# EAGLE design tinyPixel - rev A (EAGLE 6.3)
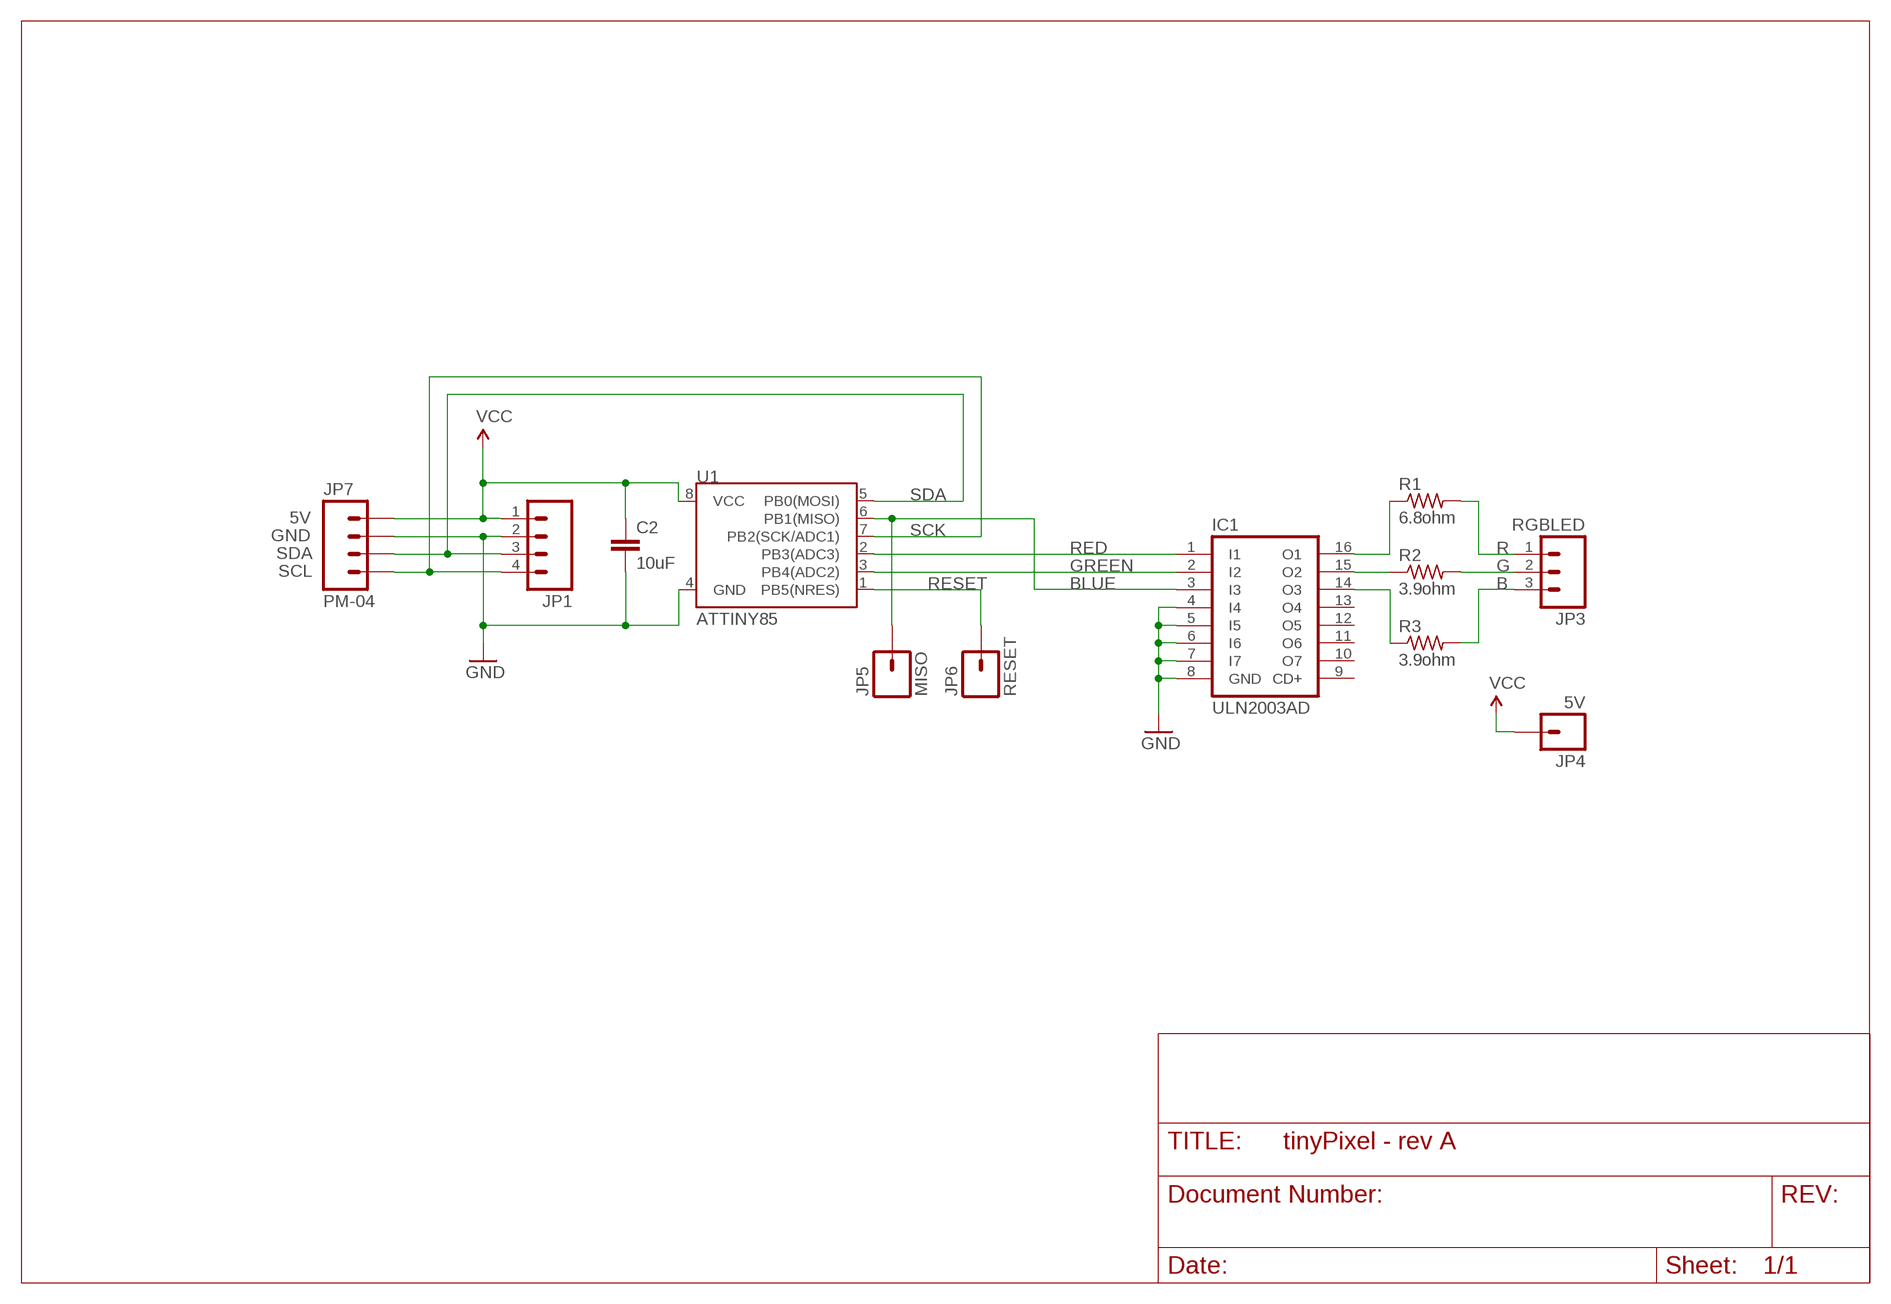
[diagram p0: schematic, sheet 1]

## Parts
C2  10uF  CAP0805  [0805]
IC1  ULN2003AD  [SO16]
JP1  M04PTH  [1X04]
JP3  RGBLED  M03PTH  [1X03]
JP4  5V  M01PTH  [1X01]
JP5  MISO  M01-SMD  [M01-SMD]
JP6  RESET  M01-SMD  [M01-SMD]
JP7  PM-04  [PM-04]
R1  6.8ohm  R-US_0411/12  [0411/12]
R2  3.9ohm  R-US_0411/12  [0411/12]
R3  3.9ohm  R-US_0411/12  [0411/12]
U1  ATTINY85  ATTINY45TINY85-20-SMT  [SO08-EIAJ]

## Nets
B: JP3.3 R3.2
BLUE: IC1.3(I3) JP5.P$2 U1.6(PB1(MISO))
G: JP3.2 R2.2
GND: C2.2 IC1.4(I4) IC1.5(I5) IC1.6(I6) IC1.7(I7) IC1.8(GND) JP1.2 JP7.P$3 U1.4(GND)
GREEN: IC1.2(I2) U1.3(PB4(ADC2))
N$1: IC1.15(O2) R2.1
N$3: IC1.14(O3) R3.1
N$5: IC1.16(O1) R1.1
R: JP3.1 R1.2
RED: IC1.1(I1) U1.2(PB3(ADC3))
RESET: JP6.P$2 U1.1(PB5(NRES))
SCK: JP1.4 JP7.P$1 U1.7(PB2(SCK/ADC1))
SDA: JP1.3 JP7.P$2 U1.5(PB0(MOSI))
VCC: C2.1 JP1.1 JP4.1 JP7.P$4 U1.8(VCC)
Unconnected: IC1.9(CD+) IC1.10(O7) IC1.11(O6) IC1.12(O5) IC1.13(O4)

## Notes on the sheet
- 5V
- GND
- SDA
- SCL

## Library data of the parts
C2 = SparkFun-Capacitors:CAP: Capacitor Standard 0603 ceramic capacitor, and 0.1" leaded capacitor.
IC1 = uln-udn:ULN2003A: DRIVER ARRAY
JP1 = SparkFun-Connectors:M04: Header 4 Standard 4-pin 0.1" header. Use with straight break away headers (SKU : PRT-00116), right angle break away headers (PRT-00553), swiss pins (PRT-00743), machine pins (PRT-00117), and female headers (PRT-00115). Molex polarized connector foot print use with SKU : PRT-08231 with associated crimp pins and housings. 1MM SMD Version SKU: PRT-10208
JP3 = SparkFun-Connectors:M03: Header 3 Standard 3-pin 0.1" header. Use with straight break away headers (SKU : PRT-00116), right angle break away headers (PRT-00553), swiss pins (PRT-00743), machine pins (PRT-00117), and female headers (PRT-00115). Molex polarized connector foot print use with SKU : PRT-08232 with associated crimp pins and housings.
JP4 = SparkFun-Connectors:M01: Header 1 Standard 1-pin 0.1" header. Use with straight break away headers (SKU : PRT-00116), right angle break away headers (PRT-00553), swiss pins (PRT-00743), machine pins (PRT-00117), and female headers (PRT-00115).
JP5 JP6 = custom-parts:M01-SMD
JP7 = custom-parts:PM-04
R1-R3 = resistor:R-US_: RESISTOR, American symbol
U1 = SparkFun-DigitalIC:ATTINY45: Atmel 8-pin 2/4/8kB flash uC; PROD_ID: IC-09092; VALUE: Tiny85-20-SMT

## Board
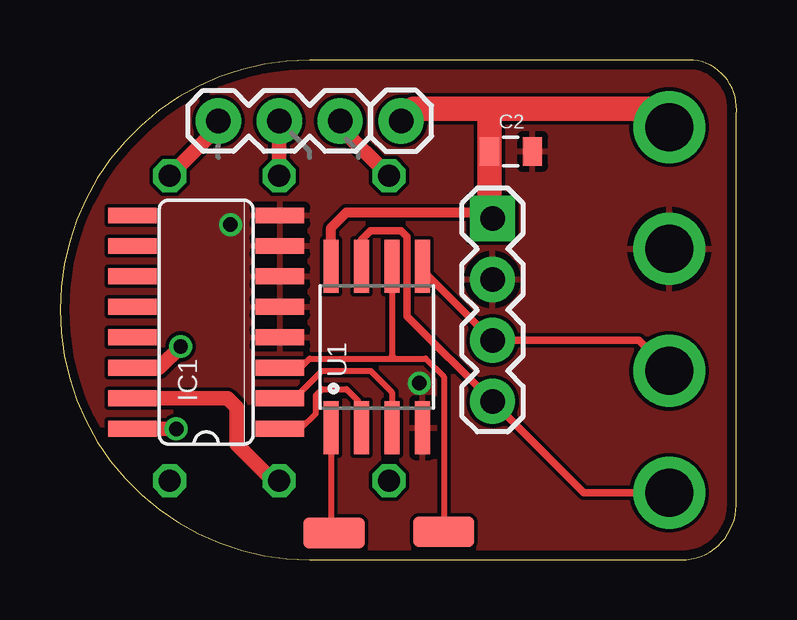
[diagram p1: board, top side]
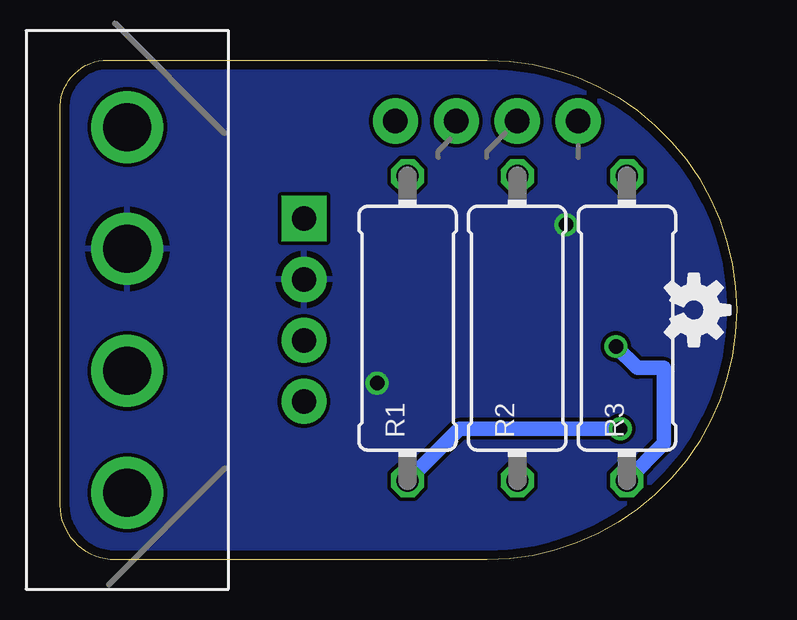
[diagram p2: board, bottom side, seen from below]

Size 28.21 x 20.83 mm. Coordinates in mm from the lower left corner, seen from the top.
Outline: 0,10.41 arc90 10.41,0 25.91,0 arc90 28.19,2.29 28.19,18.54 arc90 26.42,20.83 10.41,20.83 arc90 0,10.41
Copper layers (1*16): Top 0.0356mm / dielectric 1.5011mm / Bottom 0.0356mm
Design rules "LaenPCBOrder": minimum track width 6mil, minimum drill 13mil, track to track 6mil, track to pad 6mil, pad to pad 6mil, via to via 6mil, smd to smd 6mil, copper to edge 15mil, drill to drill 6mil, minimum pad ring 7mil, minimum via ring 7mil, stop-mask expansion 4mil, vias tented up to drill 0mil, thermal gap 10mil

### Footprints (pad centres in the part's own frame; a part is rotated, then mirrored left to right if it is on the bottom)
0805 = smd 0.8 x 1.2: 1 -0.9,0; 2 0.9,0
SO16 = smd 0.66 x 2.032: 1 -4.445,-3.073; 2 -3.175,-3.073; 3 -1.905,-3.073; 4 -0.635,-3.073; 5 0.635,-3.073; 6 1.905,-3.073; 7 3.175,-3.073; 8 4.445,-3.073; 9 4.445,3.073; 10 3.175,3.073; 11 1.905,3.073; 12 0.635,3.073; 13 -0.635,3.073; 14 -1.905,3.073; 15 -3.175,3.073; 16 -4.445,3.073
1X04 = drill 1.016 pad 1.88 square: 1 0,0 | drill 1.016 pad 1.88: 2 2.54,0; 3 5.08,0; 4 7.62,0
1X03 = drill 1.016 pad 1.88: 1 0,0; 2 2.54,0; 3 5.08,0
1X01 = drill 1.016 pad 1.88: 1 0,0
M01-SMD = smd 2.54 x 1.27: P$2 0,0
PM-04 = drill 2: P$1 -7.62,0; P$2 -2.54,0; P$3 2.54,0; P$4 7.62,0
0411/12 = drill 0.914 octagon: 1 -6.35,0; 2 6.35,0
SO08-EIAJ = smd 0.61 x 2.21: 1 -1.905,-3.378; 2 -0.635,-3.378; 3 0.635,-3.378; 4 1.905,-3.378; 5 1.905,3.353; 6 0.635,3.353; 7 -0.635,3.353; 8 -1.905,3.353

### Placement (x,y rotation side)
C2  18.8,17.02 0 top
IC1  6.1,9.91 90 top
JP1  18.03,14.22 270 top
JP3  11.68,18.29 180 top
JP4  14.22,18.29 0 top
JP5  16,1.17 180 top
JP6  11.43,1.12 0 top
JP7  25.4,10.41 90 bottom
R1  13.72,9.65 90 bottom
R2  9.14,9.65 90 bottom
R3  4.57,9.65 90 bottom
U1  13.21,8.89 0 top
U$1  [OSHW-LOGO-S]  1.78,10.41 270 bottom

### Tracks (layer width: path | path; a pad name or v marks a point on that pad's centre or on a via)
B
  Top 0.61: R3.2 6.6,18.03 JP3.3
BLUE
  Top 0.254: IC1.3 10.03,8 10.41,8.38 13.97,8.38 | 13.97,8.38 15.24,8.38 16,7.62 JP5.P$2 | U1.6 13.84,8.51 13.97,8.38
G
  Top 0.61: R2.2 JP3.2
GND  (via drill 0.6)
  other vias: 14.99,7.37 7.11,13.97
  pour Top: -0.25,-0.25 28.45,-0.25 28.45,21.08 -0.25,21.08
  pour Bottom: -0.25,-0.25 28.45,-0.25 28.45,21.08 -0.25,21.08
GREEN
  Top 0.254: IC1.2 9.78,6.73 10.92,7.87 12.95,7.87 13.84,6.99 U1.3
N$1
  Top 0.61: IC1.15 6.99,6.73 7.37,6.35 7.37,4.83 8.89,3.3 R2.1
N$3  (via drill 0.6)
  Top 0.61: IC1.14 4.14,8 v5.03,8.89
  Bottom 0.61: R3.1 3.02,4.85 IC1.14 4.14,8 v5.03,8.89
N$5  (via drill 0.6)
  Top 0.61: IC1.16 v4.85,5.46
  Bottom 0.61: v4.85,5.46 11.56,5.46 R1.1
R
  Top 0.61: R1.2 11.68,18.03 JP3.1
RED
  Top 0.254: IC1.1 10.03,5.46 10.67,6.1 10.67,6.86 10.92,7.11 11.94,7.11 12.45,6.6 12.45,5.64 U1.2
RESET
  Top 0.254: U1.1 11.3,1.04 JP6.P$2
SCK
  Top 0.305: U1.7 12.57,13.34 12.95,13.72 14.22,13.72 14.48,13.46 14.48,10.16 JP1.4 21.84,2.79 JP7.P$1
SDA
  Top 0.305: U1.5 15.11,12.06 JP1.3 24.13,9.14 JP7.P$2
VCC
  Top 0.406: U1.8 11.3,13.84 11.94,14.48 17.78,14.48 JP1.1
  Top 1.016: 17.78,14.48 17.9,14.59 C2.1 17.9,18.68 17.78,18.8 | JP4.1 14.73,18.8 17.78,18.8 | 17.78,18.8 24.64,18.8 JP7.P$4

### Text on the board
tDocu: + | B | G | R | + | - | REV A | d | c | RESET | MISO
bDocu: + | B | G | R | BLUE | GREEN | RED | + | - | d | c | tinyPixel